# Altium schematic sheet pcb_cubesat_4l_interface.SchDoc
size A4; Organization: UFSC; DocumentNumber: 2; SheetNumber: 2; SheetTotal: 2
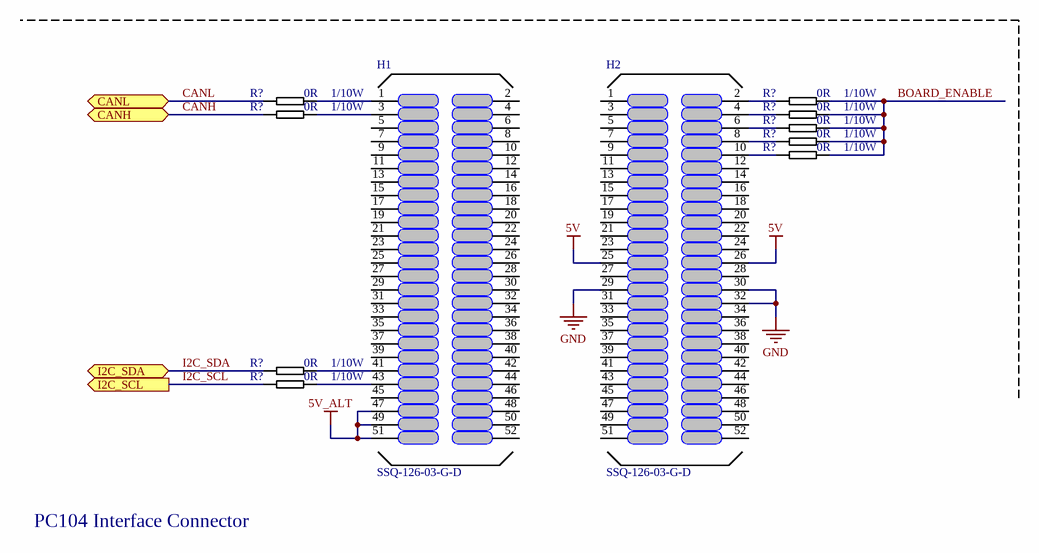
[diagram p0: pcb_cubesat_4l_interface.SchDoc]

## Parts
(Parts that share a designator on the sheet are numbered #1, #2 ... from top to bottom, then left to right.)
H1  SSQ-126-03-G-D  [HEADER 2X26 2.54mm 180 GRAUS 8.5mm length 10mm contacts length]
H2  SSQ-126-03-G-D  [HEADER 2X26 2.54mm 180 GRAUS 8.5mm length 10mm contacts length]
R?#1  value 0R  Power: 1/10W  [R0603_MD]  (hidden comment: ERJ-3GEY0R00V)
R?#2  value 0R  Power: 1/10W  [R0603_MD]  (hidden comment: ERJ-3GEY0R00V)
R?#3  value 0R  Power: 1/10W  [R0603_MD]  (hidden comment: ERJ-3GEY0R00V)
R?#4  value 0R  Power: 1/10W  [R0603_MD]  (hidden comment: ERJ-3GEY0R00V)
R?#5  value 0R  Power: 1/10W  [R0603_MD]  (hidden comment: ERJ-3GEY0R00V)
R?#6  value 0R  Power: 1/10W  [R0603_MD]  (hidden comment: ERJ-3GEY0R00V)
R?#7  value 0R  Power: 1/10W  [R0603_MD]  (hidden comment: ERJ-3GEY0R00V)
R?#8  value 0R  Power: 1/10W  [R0603_MD]  (hidden comment: ERJ-3GEY0R00V)
R?#9  value 0R  Power: 1/10W  [R0603_MD]  (hidden comment: ERJ-3GEY0R00V)

## Ports
CANH (bidir), CANL (bidir), I2C_SCL (out), I2C_SDA (bidir)

## Nets
5V: H2.25 H2.26
5V_ALT: H1.47 H1.49 H1.51
GND: H2.29 H2.30 H2.32
BOARD_ENABLE: R?#2.2 R?#4.2 R?#5.2 R?#6.2 R?#7.2
CANH: R?#3.1 ; port CANH
CANL: R?#1.1 ; port CANL
I2C_SCL: R?#9.1 ; port I2C_SCL
I2C_SDA: R?#8.1 ; port I2C_SDA
NetH1_1: H1.1 R?#1.2
NetH1_3: H1.3 R?#3.2
NetH1_41: H1.41 R?#8.2
NetH1_43: H1.43 R?#9.2
NetH2_2: H2.2 R?#2.1
NetH2_4: H2.4 R?#4.1
NetH2_6: H2.6 R?#5.1
NetH2_8: H2.8 R?#6.1
NetH2_10: H2.10 R?#7.1

Not connected (* = marked no-connect by the designer): H1 2 4 5 6 7 8 9 10 11 12 13 14 15 16 17 18 19 20 21 22 23 24 25 26 27 28 29 30 31 32 33 34 35 36 37 38 39 40 42 44 45 46 48 50 52; H2 1 3 5 7 9 11 12 13 14 15 16 17 18 19 20 21 22 23 24 27 28 31 33 34 35 36 37 38 39 40 41 42 43 44 45 46 47 48 49 50 51 52

## Notes on the sheet
- PC104 Interface Connector
- Project:
- SpaceLab - Federal University of Santa Catarina
- Title:
- Designed by:
- Project Code:
- Date:
- Revision:
- Sheet
- of
- Size:
- A4

## Library data of the parts
H1 H2 = SSQ-126-03-G-D: CONN RCPT 52POS 0.1 GOLD PCB; Manufacturer: Samtec Inc.; N of Positions: 52; Pitch: 2.54mm; Mount Type: PTH; Value: SSQ-126-03-G-D
R?#1-R?#9 = ERJ-3GEY0R00V: RES 0.0 OHM 1/10W JUMP 0603 SMD; Manufacturer: Panasonic; Tolerance: 1%; Mount Type: SMD; Supplier 1: Farnell; Supplier 2: Digi-Key; Supplier 3: Allied; Supplier 4: Newark; Supplier 5: Mouser; Supplier Part Number 1: 1652716; Supplier Part Number 2: P0.0GCT-ND; Supplier Part Number 3: 70300175; Supplier Part Number 4: 65T8702; Supplier Part Number 5: 667-ERJ-3GEY0R00V